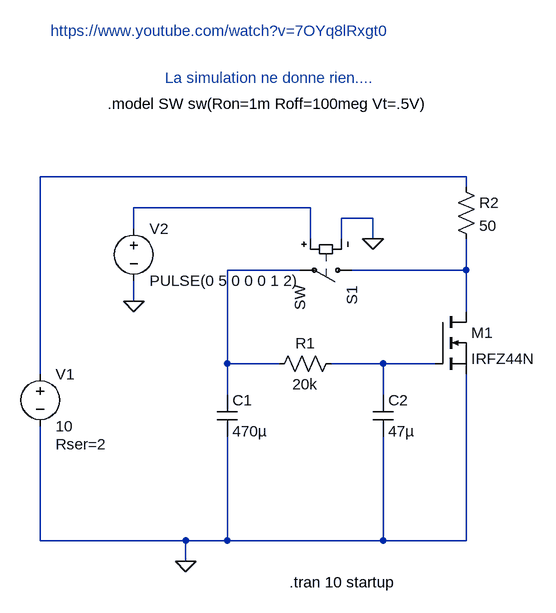
[diagram p0: schematic Switch-mosfet-1.asc]
Switch-mosfet-1.asc, the LTspice schematic file:
Version 4
SHEET 1 880 680
WIRE 480 -336 -176 -336
WIRE 480 -320 480 -336
WIRE 240 -288 -32 -288
WIRE 336 -272 288 -272
WIRE -32 -256 -32 -288
WIRE 240 -240 240 -288
WIRE 288 -240 288 -272
WIRE 336 -240 336 -272
WIRE 224 -192 112 -192
WIRE 480 -192 480 -240
WIRE 480 -192 304 -192
WIRE -32 -144 -32 -176
WIRE 480 -128 480 -192
WIRE 112 -48 112 -192
WIRE 192 -48 112 -48
WIRE 352 -48 272 -48
WIRE 432 -48 352 -48
WIRE -176 -32 -176 -336
WIRE 112 0 112 -48
WIRE 352 0 352 -48
WIRE -176 224 -176 48
WIRE 48 224 -176 224
WIRE 112 224 112 64
WIRE 112 224 48 224
WIRE 352 224 352 64
WIRE 352 224 112 224
WIRE 480 224 480 -32
WIRE 480 224 352 224
WIRE 48 256 48 224
FLAG 48 256 0
FLAG 336 -240 0
FLAG -32 -144 0
SYMBOL voltage -176 -48 R0
WINDOW 123 0 0 Left 0
WINDOW 39 24 124 Left 2
SYMATTR InstName V1
SYMATTR Value 10
SYMATTR SpiceLine Rser=2
SYMBOL res 288 -64 R90
WINDOW 0 0 56 VBottom 2
WINDOW 3 32 56 VTop 2
SYMATTR InstName R1
SYMATTR Value 20k
SYMBOL cap 96 0 R0
SYMATTR InstName C1
SYMATTR Value 470µ
SYMBOL cap 336 0 R0
SYMATTR InstName C2
SYMATTR Value 47µ
SYMBOL res 464 -336 R0
SYMATTR InstName R2
SYMATTR Value 50
SYMBOL sw 320 -192 R90
SYMATTR InstName S1
SYMBOL voltage -32 -272 R0
WINDOW 123 0 0 Left 0
WINDOW 39 0 0 Left 0
SYMATTR InstName V2
SYMATTR Value PULSE(0 5 0 0 0 1 2)
SYMBOL nmos 432 -128 R0
SYMATTR InstName M1
SYMATTR Value IRFZ44N
TEXT 208 288 Left 2 !.tran 10 startup
TEXT -72 -448 Left 2 !.model SW sw(Ron=1m Roff=100meg Vt=.5V)
TEXT -160 -560 Left 2 ;https://www.youtube.com/watch?v=7OYq8lRxgt0
TEXT 16 -488 Left 2 ;La simulation ne donne rien....

The netlist it stands for:
* Switch-mosfet-1.asc
V1 N001 0 10 Rser=2
R1 N005 N003 20k
C1 N003 0 470µ
C2 N005 0 47µ
R2 N001 N004 50
S1 N004 N003 N002 0 SW
V2 N002 0 PULSE(0 5 0 0 0 1 2)
M1 N004 N005 0 0 IRFZ44N
.model NMOS NMOS
.model PMOS PMOS
.lib standard.mos
.tran 10 startup
.model SW sw(Ron=1m Roff=100meg Vt=.5V)
* https://www.youtube.com/watch?v=7OYq8lRxgt0
* La simulation ne donne rien....
.backanno
.end